# Altium schematic sheet PWR_REGULATORS.SchDoc
size A4; SheetNumber: 5; SheetTotal: 7; DrawingNumber: 1.0; SheetSize: A4
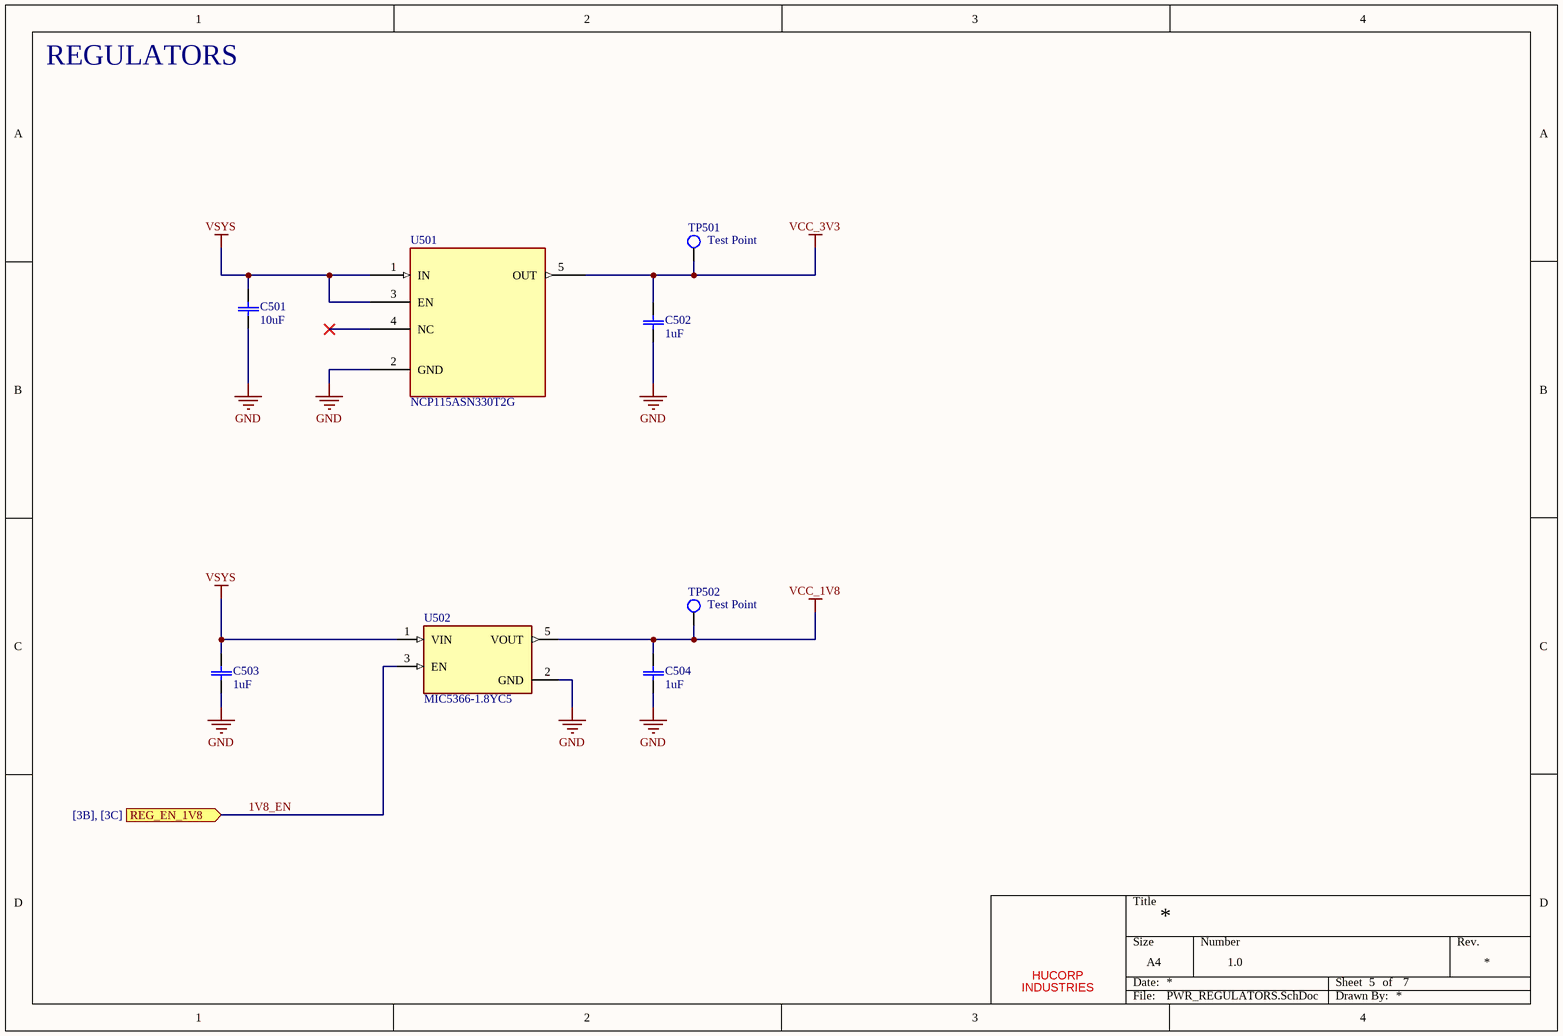
[diagram p0: PWR_REGULATORS.SchDoc]

## Parts
*  HUCORP  (value not drawn)  (graphical)
C501  value 10uF  [CAP_CL10_SAM]  (hidden comment: 10 uF)
C502  1uF  [CAP_CL10_SAM]
C503  1uF  [CAP_CL10_SAM]
C504  1uF  [CAP_CL10_SAM]
TP501  Test Point  [TestPoint1]  (no BOM)
TP502  Test Point  [TestPoint1]  (no BOM)
U501  NCP115ASN330T2G  [TSOP-5-483-N_ONS]
U502  MIC5366-1.8YC5  [SOT65P210X110-5N]

## Ports
REG_EN_1V8 (in, see [3B], [3C])

## Nets
GND: C501.1 C502.1 C503.1 C504.1 U501.2(GND) U502.2(GND)
VCC_1V8: C504.2 TP502.1 U502.5(VOUT)
VCC_3V3: C502.2 TP501.1 U501.5(OUT)
VSYS: C501.2 C503.2 U501.1(IN) U501.3(EN) U502.1(VIN)
1V8_EN: U502.3(EN) ; port REG_EN_1V8

Not connected (* = marked no-connect by the designer): U501 4(NC)*

## Notes on the sheet
- REGULATORS
- (in symbol TitleBlock1) Title; Size; Number; Rev.; INDUSTRIES; Date:; Sheet; of; File:; Drawn By:

## Library data of the parts
* = TitleBlock1: HUCORP Title Block
C501 = CL10A106MQ8NNNC: 10 µF ±20% 6.3V Ceramic Capacitor X5R 0603 (1608 Metric); Mfr_Name: Samsung; Type: DEV; Copyright: Copyright (C) 2022 Ultra Librarian. All rights reserved.; Manufacturer_Part_Number: CL10A106MQ8NNNC; Digi-Key_Part_Number_1: 1276-1119-2-ND; Digi-Key_Part_Number_2: 1276-1119-1-ND; Digi-Key_Part_Number_3: 1276-1119-6-ND; RefDes: RefDes
C502-C504 = CL10A105KA8NNNC: CAP CER 1UF 25V X5R 0603; Mfr_Name: Samsung; Manufacturer_Part_Number: CL10B104KA8NNNC; Type: DEV; Copyright: Copyright (C) 2022 Ultra Librarian. All rights reserved.; Digi-Key_Part_Number_1: 1276-1006-2-ND; Digi-Key_Part_Number_2: 1276-1006-1-ND; Digi-Key_Part_Number_3: 1276-1006-6-ND; RefDes: RefDes; Value: 1uF
TP501 TP502 = TestPoint1: General Test Point
U501 = NCP115ASN330T2G: Linear Voltage Regulator IC Positive Fixed 1 Output 300mA 5-TSOP; Mfr_Name: onsemi; Copyright: Copyright (C) 2022 Ultra Librarian. All rights reserved.; Manufacturer_Part_Number: NCP115ASN330T2G; Digi-Key_Part_Number_1: NCP115ASN330T2GOSTR-ND; Digi-Key_Part_Number_2: NCP115ASN330T2GOSCT-ND; Digi-Key_Part_Number_3: NCP115ASN330T2GOSDKR-ND; Digi-Key_Part_Number_4: 2156-NCP115ASN330T2G-OS-ND; RefDes: RefDes; Type: DEV
U502 = MIC5366-1.8YC5-TR: Linear Voltage Regulator IC Positive Fixed 1 Output 150mA SC-70-5; MF: Microchip; SnapEDA_Link: https://www.snapeda.com/parts/MIC5366-1.8YC5-TR/Microchip/view-part/?ref=snap; Package: SC-70-5 Microchip; MP: MIC5366-1.8YC5-TR; Check_prices: https://www.snapeda.com/parts/MIC5366-1.8YC5-TR/Microchip/view-part/?ref=eda; Purchase-URL: https://pricing.snapeda.com/search/part/MIC5366-1.8YC5-TR/?ref=eda; Digi-Key_Part_Number: 576-3203-2-ND; Value: *